# EAGLE design controllera (EAGLE 6.4)
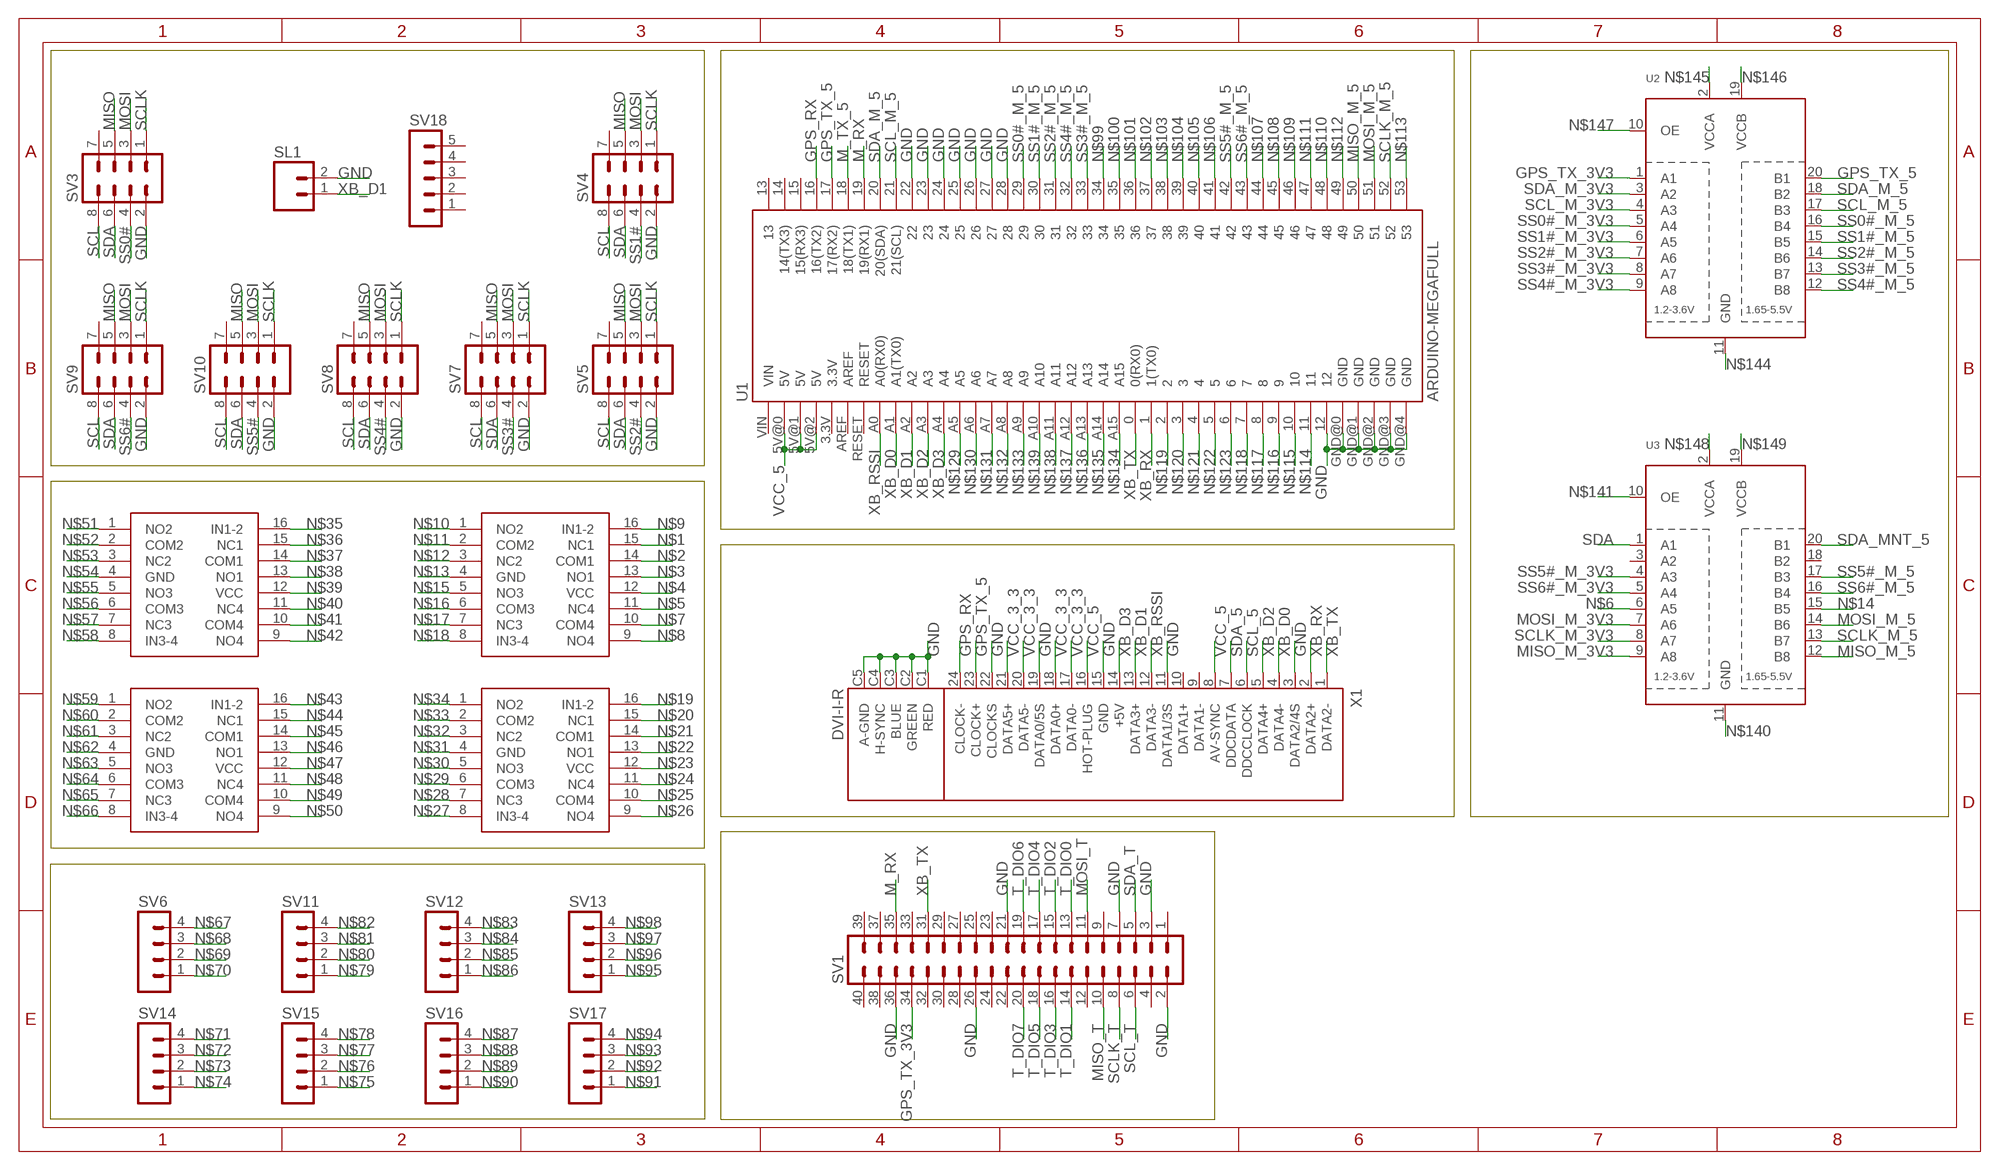
[diagram p0: schematic, sheet 1]

## Parts
SL1  MA02  [02PA]
SV1  MA20-2  [MA20-2]
SV3  MA04-2  [MA04-2]
SV4  MA04-2  [MA04-2]
SV5  MA04-2  [MA04-2]
SV6  MA04-1  [MA04-1]
SV7  MA04-2  [MA04-2]
SV8  MA04-2  [MA04-2]
SV9  MA04-2  [MA04-2]
SV10  MA04-2  [MA04-2]
SV11  MA04-1  [MA04-1]
SV12  MA04-1  [MA04-1]
SV13  MA04-1  [MA04-1]
SV14  MA04-1  [MA04-1]
SV15  MA04-1  [MA04-1]
SV16  MA04-1  [MA04-1]
SV17  MA04-1  [MA04-1]
SV18  MA05-1  [MA05-1]
U1  ARDUINO-MEGAFULL  [ARDUINO_MEGA]
U2  TXB0108PWR  [TSSOP20]
U3  TXB0108PWR  [TSSOP20]
U$1  TS3A44159PWR  [R-PDSO-G16]
U$2  TS3A44159PWR  [R-PDSO-G16]
U$3  TS3A44159PWR  [R-PDSO-G16]
U$4  TS3A44159PWR  [R-PDSO-G16]
X1  DVI-I-R  [DVI-I-R]

## Nets
GND: SL1.2 SV1.2 SV1.3 SV1.7 SV1.21 SV1.26 SV1.36 SV3.2 SV4.2 SV5.2 SV7.2 SV8.2 SV9.2 SV10.2 U1.12 U1.22 U1.23 U1.24 U1.25 U1.26 U1.27 U1.28 U1.GND@0(GND) U1.GND@1(GND) U1.GND@2(GND) U1.GND@3(GND) U1.GND@4(GND) X1.3(DATA2/4S) X1.11(DATA1/3S) X1.15(GND) X1.19(DATA0/5S) X1.22(CLOCKS) X1.C1(RED) X1.C2(GREEN) X1.C3(BLUE) X1.C4(H-SYNC) X1.C5(A-GND)
GPS_RX: U1.16(16(TX2)) X1.24(CLOCK-)
GPS_TX_3V3: SV1.34 U2.1(A1)
GPS_TX_5: U1.17(17(RX2)) U2.20(B1) X1.23(CLOCK+)
M_RX: SV1.35 U1.19(19(RX1))
M_TX_5: U1.18(18(TX1))
MISO: SV3.5 SV4.5 SV5.5 SV7.5 SV8.5 SV9.5 SV10.5
MISO_M_3V3: U3.9(A8)
MISO_M_5: U1.50 U3.12(B8)
MISO_T: SV1.10
MOSI: SV3.3 SV4.3 SV5.3 SV7.3 SV8.3 SV9.3 SV10.3
MOSI_M_3V3: U3.7(A6)
MOSI_M_5: U1.51 U3.14(B6)
MOSI_T: SV1.11
N$1: U$2.15(NC1)
N$2: U$2.14(COM1)
N$3: U$2.13(NO1)
N$4: U$2.12(VCC)
N$5: U$2.11(NC4)
N$6: U3.6(A5)
N$7: U$2.10(COM4)
N$8: U$2.9(NO4)
N$9: U$2.16(IN1-2)
N$10: U$2.1(NO2)
N$11: U$2.2(COM2)
N$12: U$2.3(NC2)
N$13: U$2.4(GND)
N$14: U3.15(B5)
N$15: U$2.5(NO3)
N$16: U$2.6(COM3)
N$17: U$2.7(NC3)
N$18: U$2.8(IN3-4)
N$19: U$4.16(IN1-2)
N$20: U$4.15(NC1)
N$21: U$4.14(COM1)
N$22: U$4.13(NO1)
N$23: U$4.12(VCC)
N$24: U$4.11(NC4)
N$25: U$4.10(COM4)
N$26: U$4.9(NO4)
N$27: U$4.8(IN3-4)
N$28: U$4.7(NC3)
N$29: U$4.6(COM3)
N$30: U$4.5(NO3)
N$31: U$4.4(GND)
N$32: U$4.3(NC2)
N$33: U$4.2(COM2)
N$34: U$4.1(NO2)
N$35: U$1.16(IN1-2)
N$36: U$1.15(NC1)
N$37: U$1.14(COM1)
N$38: U$1.13(NO1)
N$39: U$1.12(VCC)
N$40: U$1.11(NC4)
N$41: U$1.10(COM4)
N$42: U$1.9(NO4)
N$43: U$3.16(IN1-2)
N$44: U$3.15(NC1)
N$45: U$3.14(COM1)
N$46: U$3.13(NO1)
N$47: U$3.12(VCC)
N$48: U$3.11(NC4)
N$49: U$3.10(COM4)
N$50: U$3.9(NO4)
N$51: U$1.1(NO2)
N$52: U$1.2(COM2)
N$53: U$1.3(NC2)
N$54: U$1.4(GND)
N$55: U$1.5(NO3)
N$56: U$1.6(COM3)
N$57: U$1.7(NC3)
N$58: U$1.8(IN3-4)
N$59: U$3.1(NO2)
N$60: U$3.2(COM2)
N$61: U$3.3(NC2)
N$62: U$3.4(GND)
N$63: U$3.5(NO3)
N$64: U$3.6(COM3)
N$65: U$3.7(NC3)
N$66: U$3.8(IN3-4)
N$67: SV6.4
N$68: SV6.3
N$69: SV6.2
N$70: SV6.1
N$71: SV14.4
N$72: SV14.3
N$73: SV14.2
N$74: SV14.1
N$75: SV15.1
N$76: SV15.2
N$77: SV15.3
N$78: SV15.4
N$79: SV11.1
N$80: SV11.2
N$81: SV11.3
N$82: SV11.4
N$83: SV12.4
N$84: SV12.3
N$85: SV12.2
N$86: SV12.1
N$87: SV16.4
N$88: SV16.3
N$89: SV16.2
N$90: SV16.1
N$91: SV17.1
N$92: SV17.2
N$93: SV17.3
N$94: SV17.4
N$95: SV13.1
N$96: SV13.2
N$97: SV13.3
N$98: SV13.4
N$99: U1.34
N$100: U1.35
N$101: U1.36
N$102: U1.37
N$103: U1.38
N$104: U1.39
N$105: U1.40
N$106: U1.41
N$107: U1.44
N$108: U1.45
N$109: U1.46
N$110: U1.48
N$111: U1.47
N$112: U1.49
N$113: U1.53
N$114: U1.11
N$115: U1.10
N$116: U1.9
N$117: U1.8
N$118: U1.7
N$119: U1.2
N$120: U1.3
N$121: U1.4
N$122: U1.5
N$123: U1.6
N$129: U1.A5
N$130: U1.A6
N$131: U1.A7
N$132: U1.A8
N$133: U1.A9
N$134: U1.A15
N$135: U1.A14
N$136: U1.A13
N$137: U1.A12
N$138: U1.A11
N$139: U1.A10
N$140: U3.11(GND)
N$141: U3.10(OE)
N$144: U2.11(GND)
N$145: U2.2(VCCA)
N$146: U2.19(VCCB)
N$147: U2.10(OE)
N$148: U3.2(VCCA)
N$149: U3.19(VCCB)
SCL: SV3.8 SV4.8 SV5.8 SV7.8 SV8.8 SV9.8 SV10.8
SCL_5: X1.6(DDCCLOCK)
SCL_M_3V3: U2.4(A3)
SCL_M_5: U1.21(21(SCL)) U2.17(B3)
SCL_T: SV1.6
SCLK: SV3.1 SV4.1 SV5.1 SV7.1 SV8.1 SV9.1 SV10.1
SCLK_M_3V3: U3.8(A7)
SCLK_M_5: U1.52 U3.13(B7)
SCLK_T: SV1.8
SDA: SV3.6 SV4.6 SV5.6 SV7.6 SV8.6 SV9.6 SV10.6 U3.1(A1)
SDA_5: X1.7(DDCDATA)
SDA_M_3V3: U2.3(A2)
SDA_M_5: U1.20(20(SDA)) U2.18(B2)
SDA_MNT_5: U3.20(B1)
SDA_T: SV1.5
SS0#: SV3.4
SS0#_M_3V3: U2.5(A4)
SS0#_M_5: U1.29 U2.16(B4)
SS1#: SV4.4
SS1#_M_3V3: U2.6(A5)
SS1#_M_5: U1.30 U2.15(B5)
SS2#: SV5.4
SS2#_M_3V3: U2.7(A6)
SS2#_M_5: U1.31 U2.14(B6)
SS3#: SV7.4
SS3#_M_3V3: U2.8(A7)
SS3#_M_5: U1.33 U2.13(B7)
SS4#: SV8.4
SS4#_M_3V3: U2.9(A8)
SS4#_M_5: U1.32 U2.12(B8)
SS5#: SV10.4
SS5#_M_3V3: U3.4(A3)
SS5#_M_5: U1.42 U3.17(B3)
SS6#: SV9.4
SS6#_M_3V3: U3.5(A4)
SS6#_M_5: U1.43 U3.16(B4)
T_DIO0: SV1.13
T_DIO1: SV1.14
T_DIO2: SV1.15
T_DIO3: SV1.16
T_DIO4: SV1.17
T_DIO5: SV1.18
T_DIO6: SV1.19
T_DIO7: SV1.20
VCC_3_3: X1.17(DATA0-) X1.18(DATA0+) X1.20(DATA5-) X1.21(DATA5+)
VCC_5: U1.5V@0(5V) U1.5V@1(5V) U1.5V@2(5V) X1.8(AV-SYNC) X1.16(HOT-PLUG)
XB_D0: U1.A1(A1(TX0)) X1.4(DATA4-)
XB_D1: SL1.1 U1.A2 X1.13(DATA3+)
XB_D2: U1.A3 X1.5(DATA4+)
XB_D3: U1.A4 X1.14(+5V)
XB_RSSI: U1.A0(A0(RX0)) X1.12(DATA3-)
XB_RX: U1.1(1(TX0)) X1.2(DATA2+)
XB_TX: SV1.31 U1.0(0(RX0)) X1.1(DATA2-)
Unconnected: SV1.1 SV1.4 SV1.9 SV1.12 SV1.22 SV1.23 SV1.24 SV1.25 SV1.27 SV1.28 SV1.29 SV1.30 SV1.32 SV1.33 SV1.37 SV1.38 SV1.39 SV1.40 SV3.7 SV4.7 SV5.7 SV7.7 SV8.7 SV9.7 SV10.7 SV18.1 SV18.2 SV18.3 SV18.4 SV18.5 U1.3.3V U1.13 U1.14(14(TX3)) U1.15(15(RX3)) U1.AREF U1.RESET U1.VIN U3.3(A2) U3.18(B2) X1.9(DATA1-) X1.10(DATA1+)

## Power pins joined to a net without a drawn wire
AGND: X1.C6(AGND)

## Library data of the parts
SL1 = con-amp-quick:MA02: AMP QUICK CONNECTOR; OC_FARNELL: unknown; OC_NEWARK: unknown
SV1 = con-lstb:MA20-2: PIN HEADER; OC_FARNELL: unknown; OC_NEWARK: unknown
SV3-SV5 SV7-SV10 = con-lstb:MA04-2: PIN HEADER; OC_FARNELL: unknown; OC_NEWARK: unknown
SV6 SV11-SV17 = con-lstb:MA04-1: PIN HEADER; OC_FARNELL: unknown; OC_NEWARK: unknown
SV18 = con-lstb:MA05-1: PIN HEADER; OC_FARNELL: unknown; OC_NEWARK: unknown
U1 = SparkFun-Boards:ARDUINO-MEGA: Arduino Mega board footprint
U2 U3 = adafruit:TXB0108PWR: 8-Bit Bi-Directional Level Shifter 1.2V-3.6V (VCCA) to 1.65V-5.5V (VCCB) bi-directional level shifter with auto direction sensing. Max data rate - VCCA 1.8V: 20Mbps (50ns), VCCA 3.3V: 100Mbps (10ns) Digikey: 296-21527-1-ND
U$1-U$4 = kamal:TS3A44159
X1 = con-molex:DVI-I-R: CONNECTOR MiroCross(TM)-DVI i/0 plug and receptacle connector system (scart); OC_FARNELL: unknown; OC_NEWARK: unknown

## Board
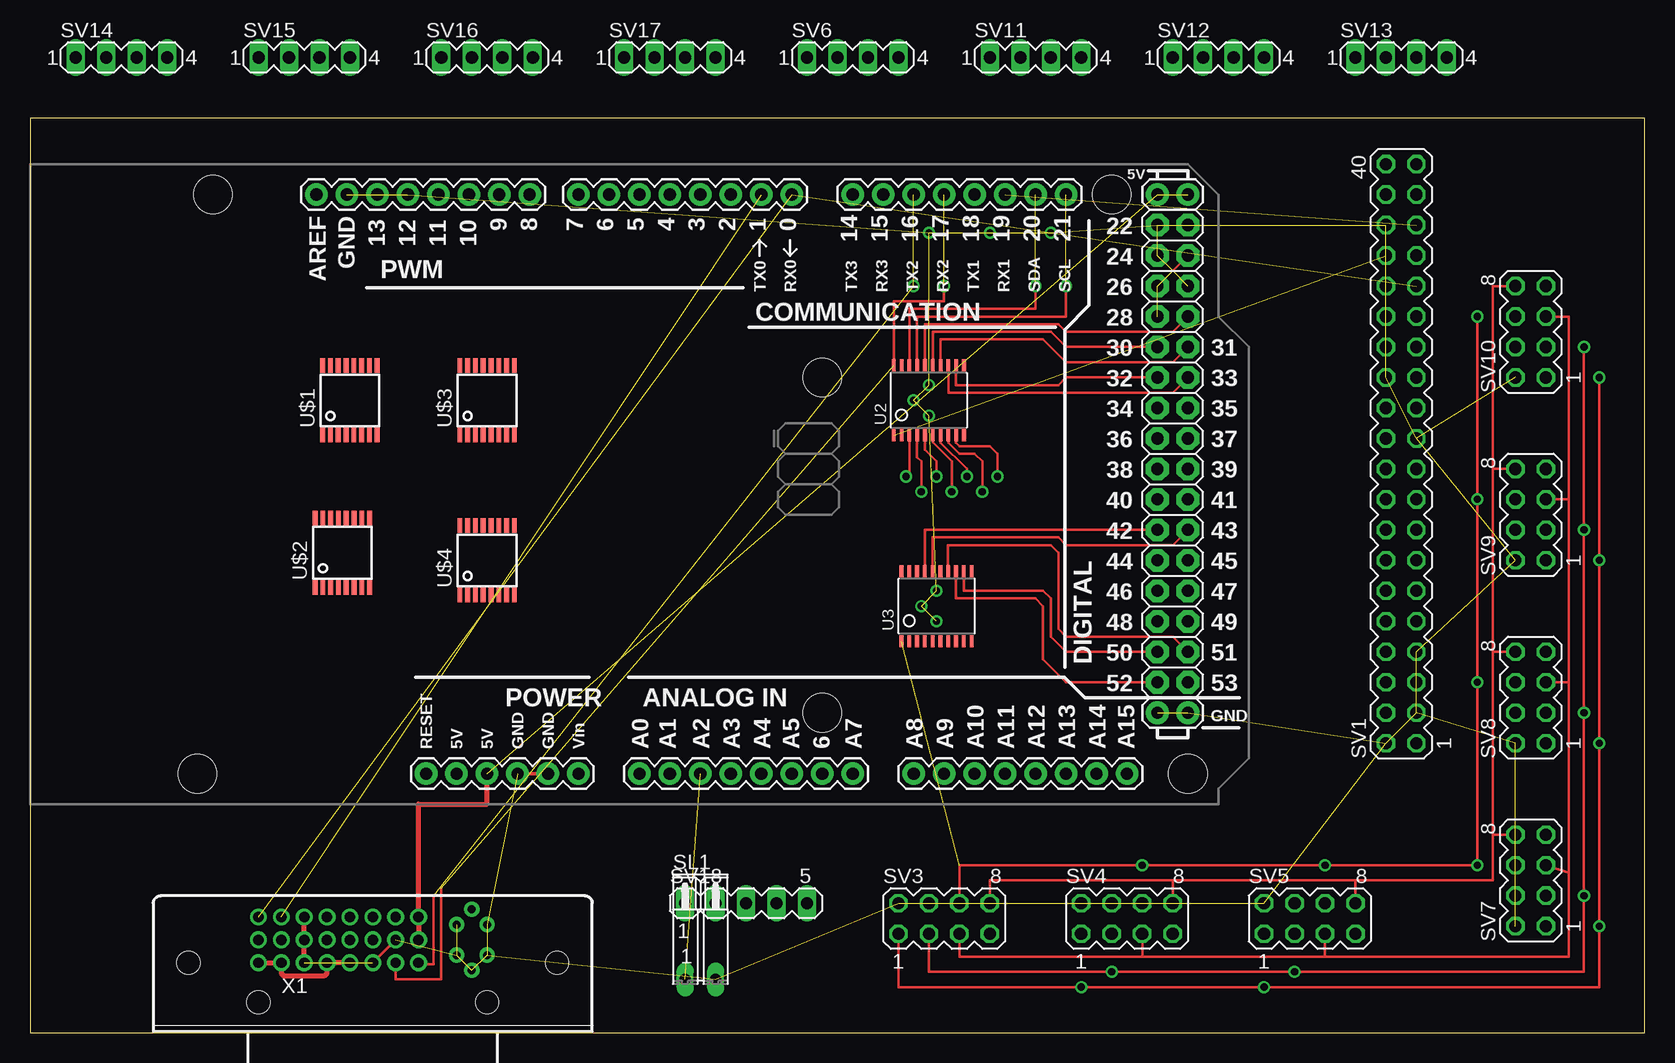
[diagram p1: board, top side]
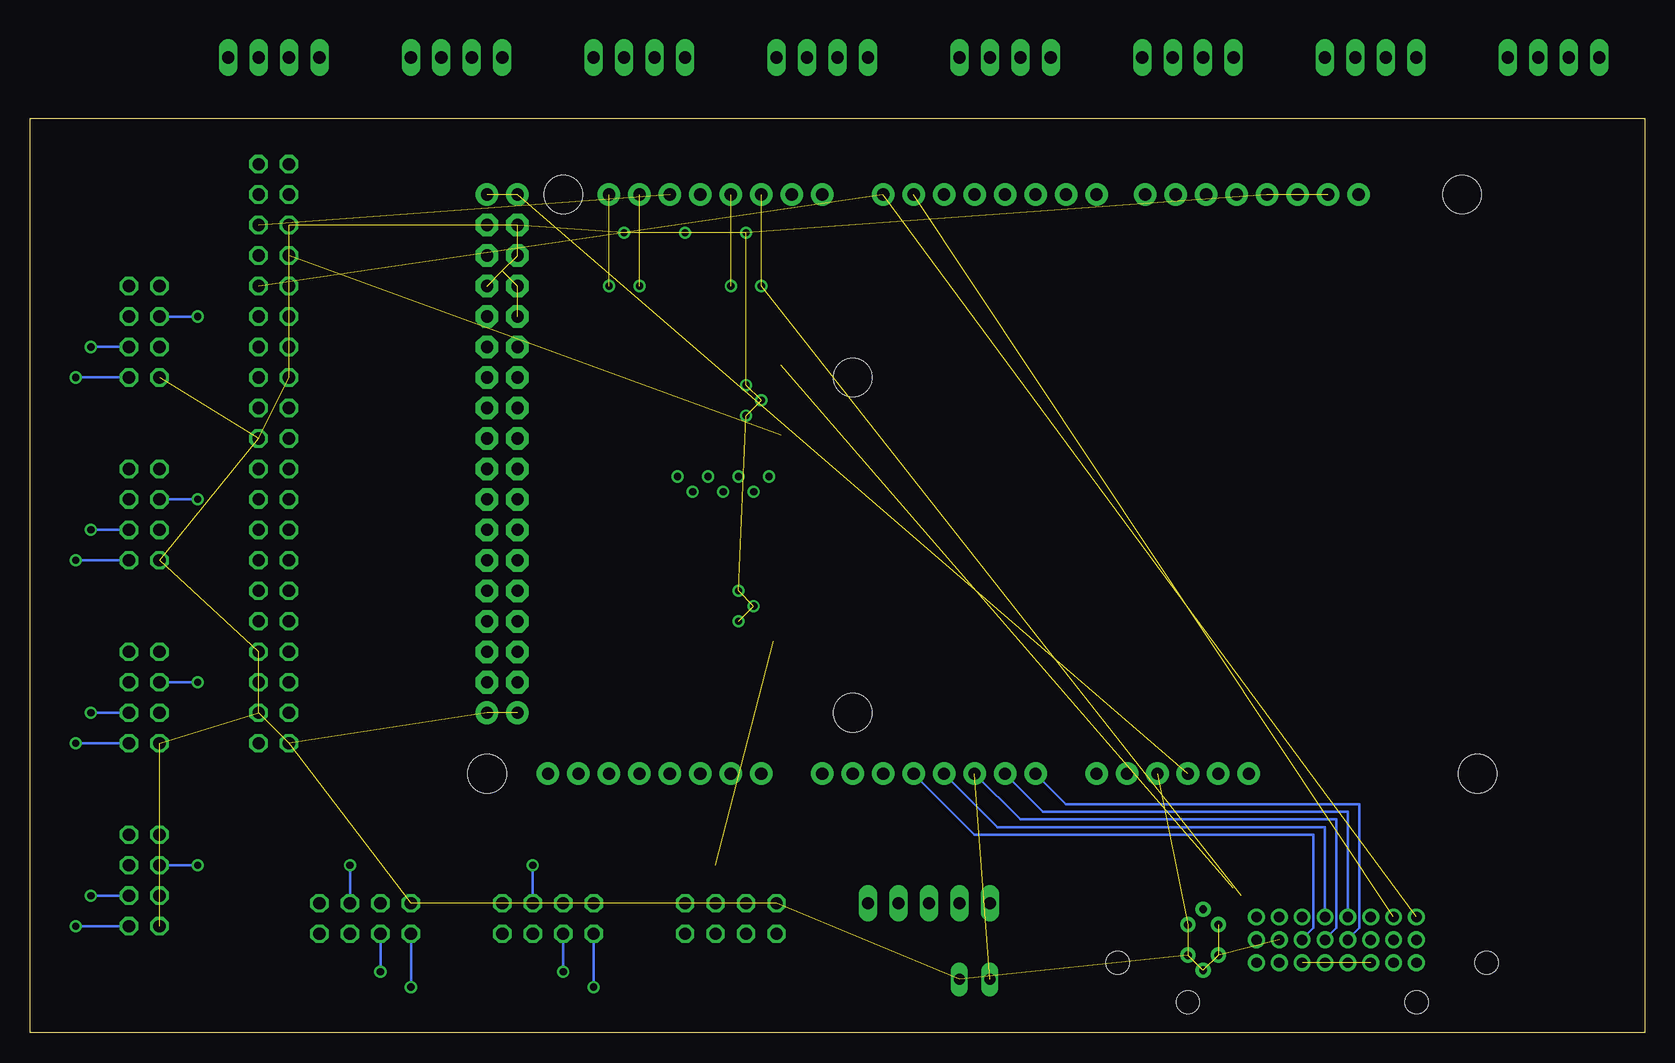
[diagram p2: board, bottom side, seen from below]

Size 134.62 x 76.2 mm. Coordinates in mm from the lower left corner, seen from the top.
Outline: 0,0 134.62,0 134.62,76.2 0,76.2 0,0
Copper layers (1*16): Top 0.035mm / dielectric 1.5mm / Bottom 0.035mm
Design rules "default": minimum track width 10mil, minimum drill 24mil, track to track 8mil, track to pad 8mil, pad to pad 8mil, via to via 8mil, smd to smd 8mil, copper to edge 40mil, drill to drill 8mil, minimum pad ring 10mil, minimum via ring 8mil, stop-mask expansion 4mil, vias tented up to drill 0mil, thermal gap 10mil

### Footprints (pad centres in the part's own frame; a part is rotated, then mirrored left to right if it is on the bottom)
02PA = drill 0.914 long: 1 -1.27,0; 2 1.27,0
MA20-2 = drill 1.016 octagon: 1 -24.13,-1.27; 2 -24.13,1.27; 3 -21.59,-1.27; 4 -21.59,1.27; 5 -19.05,-1.27; 6 -19.05,1.27; 7 -16.51,-1.27; 8 -16.51,1.27; 9 -13.97,-1.27; 10 -13.97,1.27; 11 -11.43,-1.27; 12 -11.43,1.27; 13 -8.89,-1.27; 14 -8.89,1.27; 15 -6.35,-1.27; 16 -6.35,1.27; 17 -3.81,-1.27; 18 -3.81,1.27; 19 -1.27,-1.27; 20 -1.27,1.27; 21 1.27,-1.27; 22 1.27,1.27; 23 3.81,-1.27; 24 3.81,1.27; 25 6.35,-1.27; 26 6.35,1.27; 27 8.89,-1.27; 28 8.89,1.27; 29 11.43,-1.27; 30 11.43,1.27; 31 13.97,-1.27; 32 13.97,1.27; 33 16.51,-1.27; 34 16.51,1.27; 35 19.05,-1.27; 36 19.05,1.27; 37 21.59,-1.27; 38 21.59,1.27; 39 24.13,-1.27; 40 24.13,1.27
MA04-2 = drill 1.016 octagon: 1 -3.81,-1.27; 2 -3.81,1.27; 3 -1.27,-1.27; 4 -1.27,1.27; 5 1.27,-1.27; 6 1.27,1.27; 7 3.81,-1.27; 8 3.81,1.27
MA04-1 = drill 1.016 long: 1 -3.81,0; 2 -1.27,0; 3 1.27,0; 4 3.81,0
MA05-1 = drill 1.016 long: 1 -5.08,0; 2 -2.54,0; 3 0,0; 4 2.54,0; 5 5.08,0
ARDUINO_MEGA = drill 1.016 pad 1.88: 0 63.5,50.8; 1 60.96,50.8; 2 58.42,50.8; 3 55.88,50.8; 3.3V 35.56,2.54; 4 53.34,50.8; 5 50.8,50.8; 5V@0 38.1,2.54; 5V@1 93.98,50.8; 5V@2 96.52,50.8; 6 48.26,50.8; 7 45.72,50.8; 8 41.656,50.8; 9 39.116,50.8; 10 36.576,50.8; 11 34.036,50.8; 12 31.496,50.8; 13 28.956,50.8; 14 68.58,50.8; 15 71.12,50.8; 16 73.66,50.8; 17 76.2,50.8; 18 78.74,50.8; 19 81.28,50.8; 20 83.82,50.8; 21 86.36,50.8; A0 50.8,2.54; A1 53.34,2.54; A2 55.88,2.54; A3 58.42,2.54; A4 60.96,2.54; A5 63.5,2.54; A6 66.04,2.54; A7 68.58,2.54; A8 73.66,2.54; A9 76.2,2.54; A10 78.74,2.54; A11 81.28,2.54; A12 83.82,2.54; A13 86.36,2.54; A14 88.9,2.54; A15 91.44,2.54; AREF 23.876,50.8; GND@0 40.64,2.54; GND@1 43.18,2.54; GND@2 93.98,7.62; GND@3 96.52,7.62; GND@4 26.416,50.8; RESET 33.02,2.54; VIN 45.72,2.54 | drill 1.016 pad 1.88 octagon: 22 93.98,48.26; 23 96.52,48.26; 24 93.98,45.72; 25 96.52,45.72; 26 93.98,43.18; 27 96.52,43.18; 28 93.98,40.64; 29 96.52,40.64; 30 93.98,38.1; 31 96.52,38.1; 32 93.98,35.56; 33 96.52,35.56; 34 93.98,33.02; 35 96.52,33.02; 36 93.98,30.48; 37 96.52,30.48; 38 93.98,27.94; 39 96.52,27.94; 40 93.98,25.4; 41 96.52,25.4; 42 93.98,22.86; 43 96.52,22.86; 44 93.98,20.32; 45 96.52,20.32; 46 93.98,17.78; 47 96.52,17.78; 48 93.98,15.24; 49 96.52,15.24; 50 93.98,12.7; 51 96.52,12.7; 52 93.98,10.16; 53 96.52,10.16 | hole 3.2: 15.24,50.8; 13.97,2.54; 66.04,35.56; 66.04,7.62; 90.17,50.8; 96.52,2.54
TSSOP20 = smd 0.305 x 0.991: 1 -2.925,-2.918; 2 -2.275,-2.918; 3 -1.625,-2.918; 4 -0.975,-2.918; 5 -0.325,-2.918; 6 0.325,-2.918; 7 0.975,-2.918; 8 1.625,-2.918; 9 2.275,-2.918; 10 2.925,-2.918; 11 2.925,2.918; 12 2.275,2.918; 13 1.625,2.918; 14 0.975,2.918; 15 0.325,2.918; 16 -0.325,2.918; 17 -0.975,2.918; 18 -1.625,2.918; 19 -2.275,2.918; 20 -2.925,2.918
R-PDSO-G16 = smd 0.4 x 1.2: 1 -2.275,-2.9; 2 -1.625,-2.9; 3 -0.975,-2.9; 4 -0.325,-2.9; 5 0.325,-2.9; 6 0.975,-2.9; 7 1.625,-2.9; 8 2.275,-2.9; 9 2.275,2.9; 10 1.625,2.9; 11 0.975,2.9; 12 0.325,2.9; 13 -0.325,2.9; 14 -0.975,2.9; 15 -1.625,2.9; 16 -2.275,2.9
DVI-I-R = drill 0.864 pad 1.397: 1 -9.525,6.985; 2 -7.62,6.985; 3 -5.715,6.985; 4 -3.81,6.985; 5 -1.905,6.985; 6 0,6.985; 7 1.905,6.985; 8 3.81,6.985; 9 -9.525,5.08; 10 -7.62,5.08; 11 -5.715,5.08; 12 -3.81,5.08; 13 -1.905,5.08; 14 0,5.08; 15 1.905,5.08; 16 3.81,5.08; 17 -9.525,3.175; 18 -7.62,3.175; 19 -5.715,3.175; 20 -3.81,3.175; 21 -1.905,3.175; 22 0,3.175; 23 1.905,3.175; 24 3.81,3.175 | drill 0.66 pad 1.27: C1 6.985,6.35; C2 9.525,6.35; C3 6.985,3.81; C4 9.525,3.81; C5 8.255,2.54; C6 8.255,7.62 | hole 1.93: -15.367,3.175; 15.367,3.175; -9.525,-0.127; 9.525,-0.127

### Placement (x,y rotation side)
SL1  55.88,4.45 0 top
SV1  114.3,48.26 90 top
SV3  76.2,9.53 0 top
SV4  91.44,9.53 0 top
SV5  106.68,9.53 0 top
SV6  68.58,81.28 0 top  (outside the outline)
SV7  125.09,12.7 90 top
SV8  125.09,27.94 90 top
SV9  125.09,43.18 90 top
SV10  125.09,58.42 90 top
SV11  83.82,81.28 0 top  (outside the outline)
SV12  99.06,81.28 0 top  (outside the outline)
SV13  114.3,81.28 0 top  (outside the outline)
SV14  7.62,81.28 0 top  (outside the outline)
SV15  22.86,81.28 0 top  (outside the outline)
SV16  38.1,81.28 0 top  (outside the outline)
SV17  53.34,81.28 0 top  (outside the outline)
SV18  59.69,10.79 0 top
U1  0,19.05 0 top
U2  74.93,52.7 0 top
U3  75.56,35.56 0 top
U$1  26.67,52.7 0 top
U$2  26.04,40.01 0 top
U$3  38.1,52.7 0 top
U$4  38.1,39.37 0 top
X1  28.57,2.67 0 top

### Tracks (layer width: path | path; a pad name or v marks a point on that pad's centre or on a via)
GND  (via drill 0.6)  (41 unrouted)
  Top 0.203: X1.3 X1.11 | 95.25,63.5 U1.25
  Top 0.254: X1.22 X1.15
  Top 0.305: U1.GND@0 U1.GND@1
  Top 0.406: X1.19 X1.3
  other vias: 75.56,36.83 74.3,35.56 75.56,34.29 74.93,53.98 73.66,52.7 74.93,51.44 80.01,66.67 74.93,66.67 85.09,66.67
GPS_RX  (via drill 0.6)  (2 unrouted)
  Top 0.203: X1.24 32.38,5.71 33.66,5.71 33.66,11.43
  other vias: 73.66,62.23
GPS_TX_3V3  (1 unrouted)
GPS_TX_5  (via drill 0.6)  (2 unrouted)
  Top 0.203: X1.23 30.48,4.45 34.29,4.45 34.29,12.06 | v76.2,62.23 76.2,60.96 72,60.96 U2.20
M_RX  (1 unrouted)
MISO
  Top 0.203: SV3.5 77.47,6.35 92.71,6.35 | SV4.5 92.71,6.35 | 92.71,6.35 107.95,6.35 | 107.95,6.35 128.27,6.35 128.27,13.34 | 128.27,13.34 128.27,29.21 | 128.27,29.21 128.27,44.45 | 128.27,44.45 128.27,59.69 SV10.5 | SV8.5 128.27,29.21 | SV9.5 128.27,44.45 | SV7.5 128.27,13.34 | SV5.5 107.95,6.35
MISO_M_5
  Top 0.203: U1.50 86.36,31.75 85.09,33.02 85.09,36.2 84.45,36.83 77.84,36.83 U3.12
MOSI  (via drill 0.6)
  Top 0.203: SV3.3 74.93,5.08 v90.17,5.08 v105.41,5.08 129.54,5.08 v129.54,11.43 v129.54,26.67 v129.54,41.91 v129.54,57.15
  Bottom 0.203: SV4.3 v90.17,5.08 | SV5.3 v105.41,5.08 | SV7.3 v129.54,11.43 | SV8.3 v129.54,26.67 | SV9.3 v129.54,41.91 | SV10.3 v129.54,57.15
MOSI_M_5
  Top 0.203: U1.51 95.25,33.02 86.36,33.02 85.72,33.66 85.72,40.01 85.09,40.64 76.54,40.64 U3.14
SCL
  Top 0.203: SV3.8 80.01,12.7 95.25,12.7 | SV4.8 95.25,12.7 | 95.25,12.7 110.49,12.7 | 110.49,12.7 121.92,12.7 121.92,16.51 | 121.92,16.51 121.92,31.75 | 121.92,31.75 121.92,46.99 | 121.92,46.99 121.92,62.23 SV10.8 | SV5.8 110.49,12.7 | SV7.8 121.92,16.51 | SV8.8 121.92,31.75 | SV9.8 121.92,46.99
SCL_M_3V3  (via drill 0.6)
  Top 0.203: U2.4 73.95,47.97 74.3,47.62 v74.3,45.09
SCL_M_5  (via drill 0.6)  (1 unrouted)
  Top 0.203: v86.36,62.23 86.36,59.69 73.95,59.69 U2.17
SCLK  (via drill 0.6)
  Top 0.203: SV3.1 72.39,3.81 v87.63,3.81 v102.87,3.81 130.81,3.81 v130.81,8.89 v130.81,24.13 v130.81,39.37 v130.81,54.61
  Bottom 0.203: SV4.1 v87.63,3.81 | SV5.1 v102.87,3.81 | SV7.1 v130.81,8.89 | SV8.1 v130.81,24.13 | SV9.1 v130.81,39.37 | SV10.1 v130.81,54.61
SCLK_M_5
  Top 0.203: U1.52 86.36,29.21 84.45,31.11 84.45,35.56 83.82,36.2 77.19,36.2 U3.13
SDA  (via drill 0.6)  (1 unrouted)
  Top 0.203: SV3.6 77.47,13.97 v92.71,13.97 v107.95,13.97 v120.65,13.97 v120.65,29.21 v120.65,44.45 v120.65,59.69
  Bottom 0.203: SV4.6 v92.71,13.97 | SV8.6 v120.65,29.21 | SV9.6 v120.65,44.45 | SV10.6 v120.65,59.69 | SV5.6 v107.95,13.97 | v120.65,13.97 SV7.6
SDA_M_3V3  (via drill 0.6)
  Top 0.203: U2.3 73.31,46.63 v73.03,46.35
SDA_M_5  (via drill 0.6)  (1 unrouted)
  Top 0.203: v83.82,62.23 83.82,60.33 73.31,60.33 U2.18
SS0#_M_3V3  (via drill 0.6)
  Top 0.203: U2.5 74.61,48.59 75.56,47.62 v75.56,46.35
SS0#_M_5
  Top 0.203: U1.29 95.25,58.42 86.36,58.42 85.72,59.05 74.61,59.05 U2.16
SS1#_M_3V3  (via drill 0.6)
  Top 0.203: U2.6 75.25,49.2 76.83,47.62 v76.83,45.09
SS1#_M_5
  Top 0.203: U1.30 86.36,57.15 85.09,58.42 75.25,58.42 U2.15
SS2#_M_3V3  (via drill 0.6)
  Top 0.203: U2.7 75.91,49.19 78.11,46.99 v78.11,46.35
SS2#_M_5
  Top 0.203: U1.31 95.25,55.88 86.36,55.88 84.45,57.78 75.91,57.78 U2.14
SS3#_M_3V3  (via drill 0.6)
  Top 0.203: U2.8 76.56,49.17 77.47,48.26 78.74,48.26 79.38,47.62 v79.38,45.09
SS3#_M_5
  Top 0.203: U1.33 95.25,53.34 76.56,53.34 U2.13
SS4#_M_3V3  (via drill 0.6)
  Top 0.203: U2.9 77.2,49.16 77.47,48.9 80.01,48.9 80.64,48.26 v80.64,46.35
SS4#_M_5
  Top 0.203: U1.32 86.36,54.61 85.72,53.98 77.2,53.98 U2.12
SS5#_M_5
  Top 0.203: U1.42 74.59,41.91 U3.17
SS6#_M_5
  Top 0.203: U1.43 95.25,40.64 86.36,40.64 85.72,41.27 75.24,41.27 U3.16
VCC_3_3
  Top 0.406: X1.21 X1.20 24.77,4.95 24.57,4.76 21.14,4.76 20.95,4.95 X1.18 X1.17
VCC_5  (2 unrouted)
  Top 0.406: X1.16 X1.8 32.38,19.05 38.1,19.05 U1.5V@0
XB_D0
  Bottom 0.203: X1.4 24.77,18.41 50.16,18.41 U1.A1
XB_D1  (1 unrouted)
  Bottom 0.203: X1.13 26.67,7.81 25.72,8.76 25.72,17.78 52.07,17.78 U1.A2
XB_D2
  Bottom 0.203: X1.5 26.67,17.14 53.98,17.14 U1.A3
XB_D3
  Bottom 0.203: X1.14 28.57,7.81 27.62,8.76 27.62,16.51 55.88,16.51 U1.A4
XB_RSSI
  Bottom 0.203: X1.12 24.77,7.81 23.81,8.76 23.81,19.05 48.26,19.05 U1.A0
XB_RX  (1 unrouted)
XB_TX  (2 unrouted)